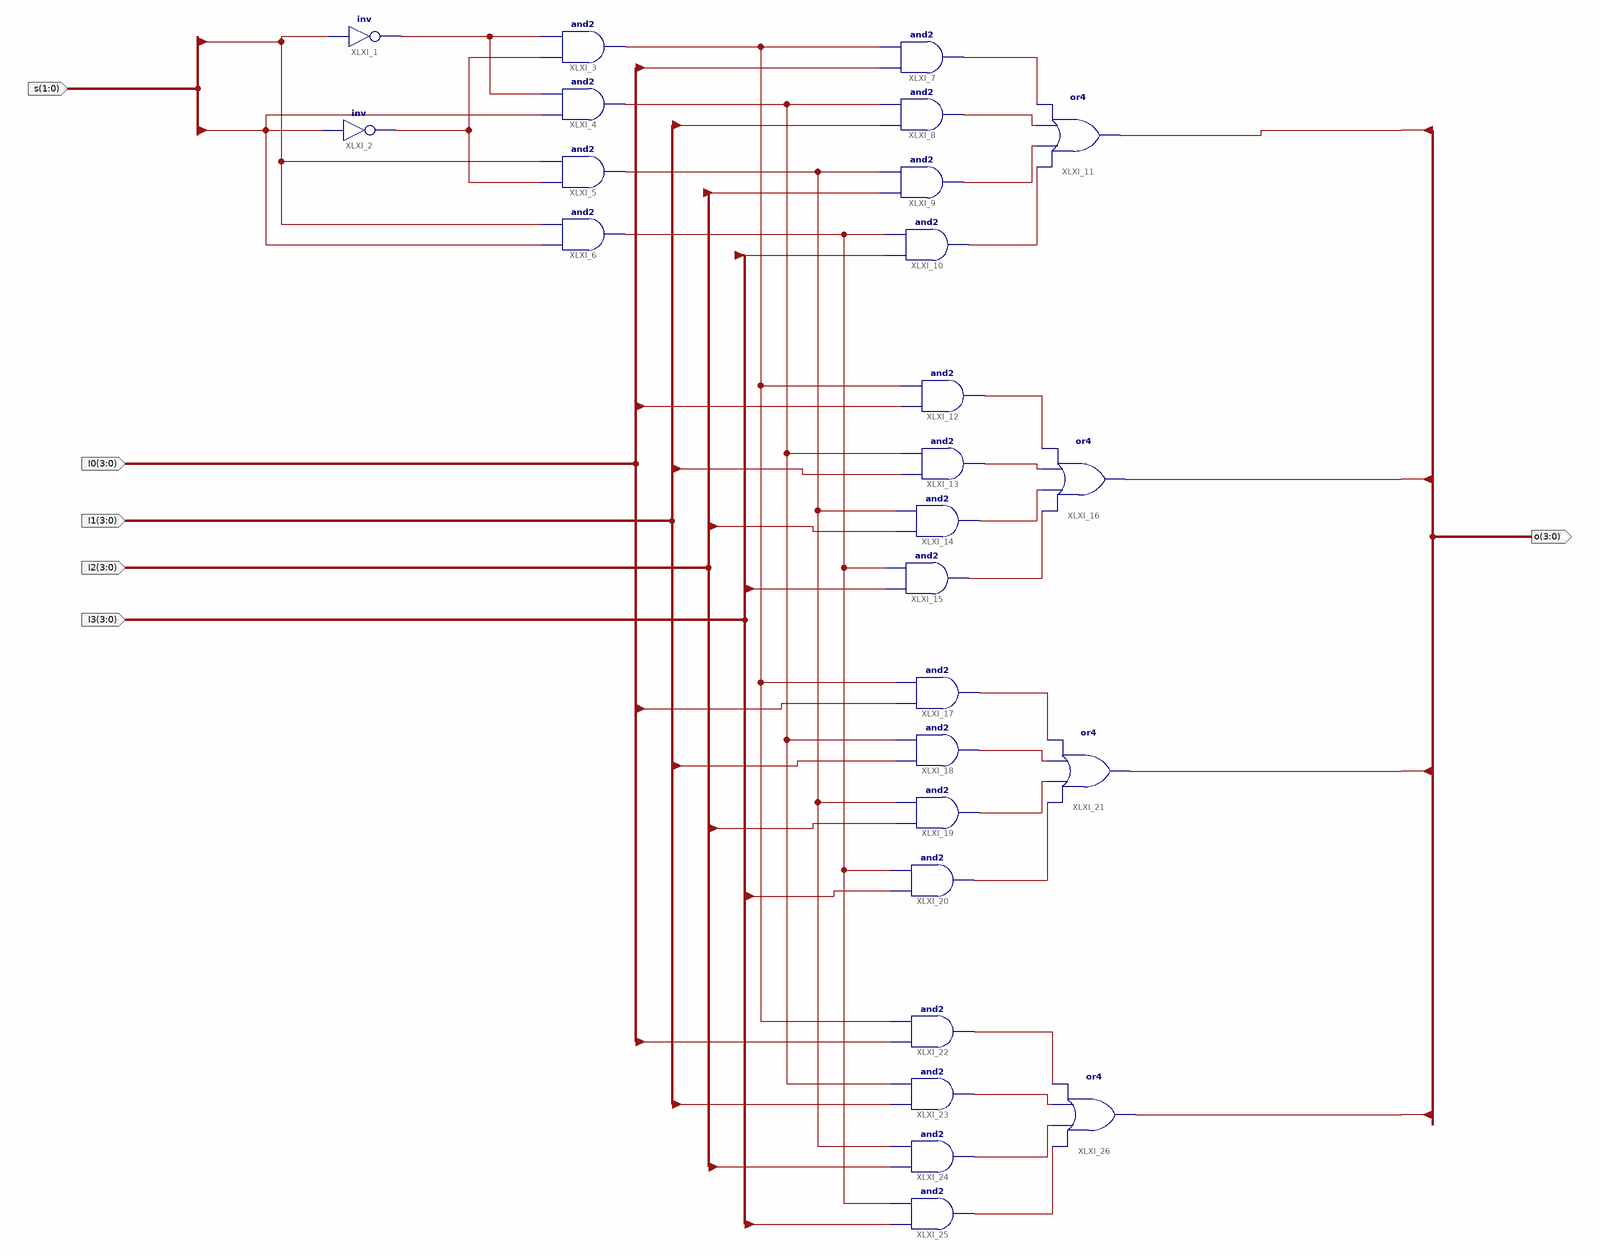
[diagram p0: schematic sheet 1]
// Xilinx ISE schematic MUX4T1_4.sch (spartan3) as structural Verilog: 26 symbols, 6 ports
module MUX4T1_4 (
  input  [1:0] s,
  input  [3:0] I0,
  input  [3:0] I1,
  input  [3:0] I2,
  input  [3:0] I3,
  output [3:0] o
);

  wire XLXN_5, XLXN_7, XLXN_20, XLXN_21, XLXN_22, XLXN_23, XLXN_24, XLXN_25, XLXN_26, XLXN_27, XLXN_28,
       XLXN_29, XLXN_30, XLXN_31, XLXN_32, XLXN_33, XLXN_34, XLXN_35, XLXN_43, XLXN_46, XLXN_49, XLXN_52;

  not XLXI_1 (XLXN_7, s[1]);
  not XLXI_2 (XLXN_5, s[0]);
  and XLXI_3 (XLXN_43, XLXN_5, XLXN_7);
  and XLXI_4 (XLXN_46, s[0], XLXN_7);
  and XLXI_5 (XLXN_49, XLXN_5, s[1]);
  and XLXI_6 (XLXN_52, s[0], s[1]);
  and XLXI_7 (XLXN_20, I0[0], XLXN_43);
  and XLXI_8 (XLXN_21, I1[0], XLXN_46);
  and XLXI_9 (XLXN_22, I2[0], XLXN_49);
  and XLXI_10 (XLXN_23, I3[0], XLXN_52);
  or XLXI_11 (o[0], XLXN_23, XLXN_22, XLXN_21, XLXN_20);
  and XLXI_12 (XLXN_24, I0[1], XLXN_43);
  and XLXI_13 (XLXN_25, I1[1], XLXN_46);
  and XLXI_14 (XLXN_26, I2[1], XLXN_49);
  and XLXI_15 (XLXN_27, I3[1], XLXN_52);
  or XLXI_16 (o[1], XLXN_27, XLXN_26, XLXN_25, XLXN_24);
  and XLXI_17 (XLXN_28, I0[2], XLXN_43);
  and XLXI_18 (XLXN_29, I1[2], XLXN_46);
  and XLXI_19 (XLXN_30, I2[2], XLXN_49);
  and XLXI_20 (XLXN_31, I3[2], XLXN_52);
  or XLXI_21 (o[2], XLXN_31, XLXN_30, XLXN_29, XLXN_28);
  and XLXI_22 (XLXN_32, I0[3], XLXN_43);
  and XLXI_23 (XLXN_33, I1[3], XLXN_46);
  and XLXI_24 (XLXN_34, I2[3], XLXN_49);
  and XLXI_25 (XLXN_35, I3[3], XLXN_52);
  or XLXI_26 (o[3], XLXN_35, XLXN_34, XLXN_33, XLXN_32);
endmodule
